# Altium schematic sheet Amphenol ICC_2.SchDoc
size A4; SheetNumber: 4; SheetTotal: 6
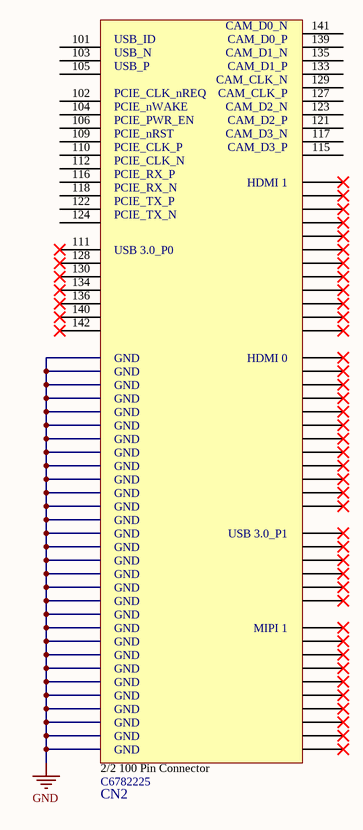
[diagram p0: Amphenol ICC_2.SchDoc]

## Parts
CN2  2/2 100 Pin Connector  Name: C6782225  [CONN-SMD_100P-P0.40_10164227-1001A1RLF]

## Nets
GND: CN2.107(GND) CN2.108(GND) CN2.113(GND) CN2.114(GND) CN2.119(GND) CN2.120(GND) CN2.125(GND) CN2.126(GND) CN2.131(GND) CN2.132(GND) CN2.137(GND) CN2.138(GND) CN2.144(GND) CN2.150(GND) CN2.155(GND) CN2.156(GND) CN2.161(GND) CN2.162(GND) CN2.167(GND) CN2.168(GND) CN2.173(GND) CN2.174(GND) CN2.179(GND) CN2.180(GND) CN2.185(GND) CN2.186(GND) CN2.191(GND) CN2.192(GND) CN2.197(GND) CN2.198(GND)

Not connected (* = marked no-connect by the designer): CN2 101(USB_ID) 102(PCIe_CLK_REQ) 103(USB_N) 104(PCIe_WAKE) 105(USB_P) 106(PCIE_PWR_EN) 109(PCIE_RST) 110(PCIe_CLK_P) 111 112(PCIe_CLK_N) 115(MIPI_D0_N) 116(PCIe_RX_P) 117(MIPI_D0_P) 118(PCIe_RX_N) 121(MIPI_D1_N) 122(PCIe_TX_P) 123(MIPI_D1_P) 124(PCIe_TX_N) 127(MIPI_C_N) 128 129(MIPI_C_P) 130 133(MIPI_D2_N) 134 135(MIPI_D2_P) 136 139(MIPI_D3_N) 140 141(MIPI_D3_P) 142 143 145 146 147 148 149 151 152 153 154 157 158 159 160 163 164 165 166 169 170 171 172 175 176 177 178 181 182 183 184 187 188 189 190 193 194 195 196 199 200

## Notes on the sheet
- (in symbol 10164227-1001A1RLF) CAM_D0_N; CAM_D0_P; CAM_D1_N; CAM_D1_P; CAM_CLK_N; PCIE_CLK_nREQ; CAM_CLK_P; PCIE_nWAKE; CAM_D2_N; CAM_D2_P; PCIE_nRST; CAM_D3_N; PCIE_CLK_P; CAM_D3_P; PCIE_CLK_N; PCIE_RX_P; HDMI 1; PCIE_RX_N; PCIE_TX_P; PCIE_TX_N; USB 3.0_P0; HDMI 0; USB 3.0_P1; MIPI 1

## Library data of the parts
CN2 = 10164227-1001A1RLF: 100 Position Board to Board Connector Surface Mount,P=0.4mm Gold; Source: LCSC